# Altium schematic sheet FPGA_IO.SchDoc: FPGA IO
size 635 x 635 mm; Organization: UCLA High Energy Physics; DocumentNumber: 3; Revision: 2.0; SheetNumber: 3; SheetTotal: 12; CurrentDate: 8/7/2018; ModifiedDate: 8/20/2018; ProjectName: ALCT S-6 Optical Mezzanine
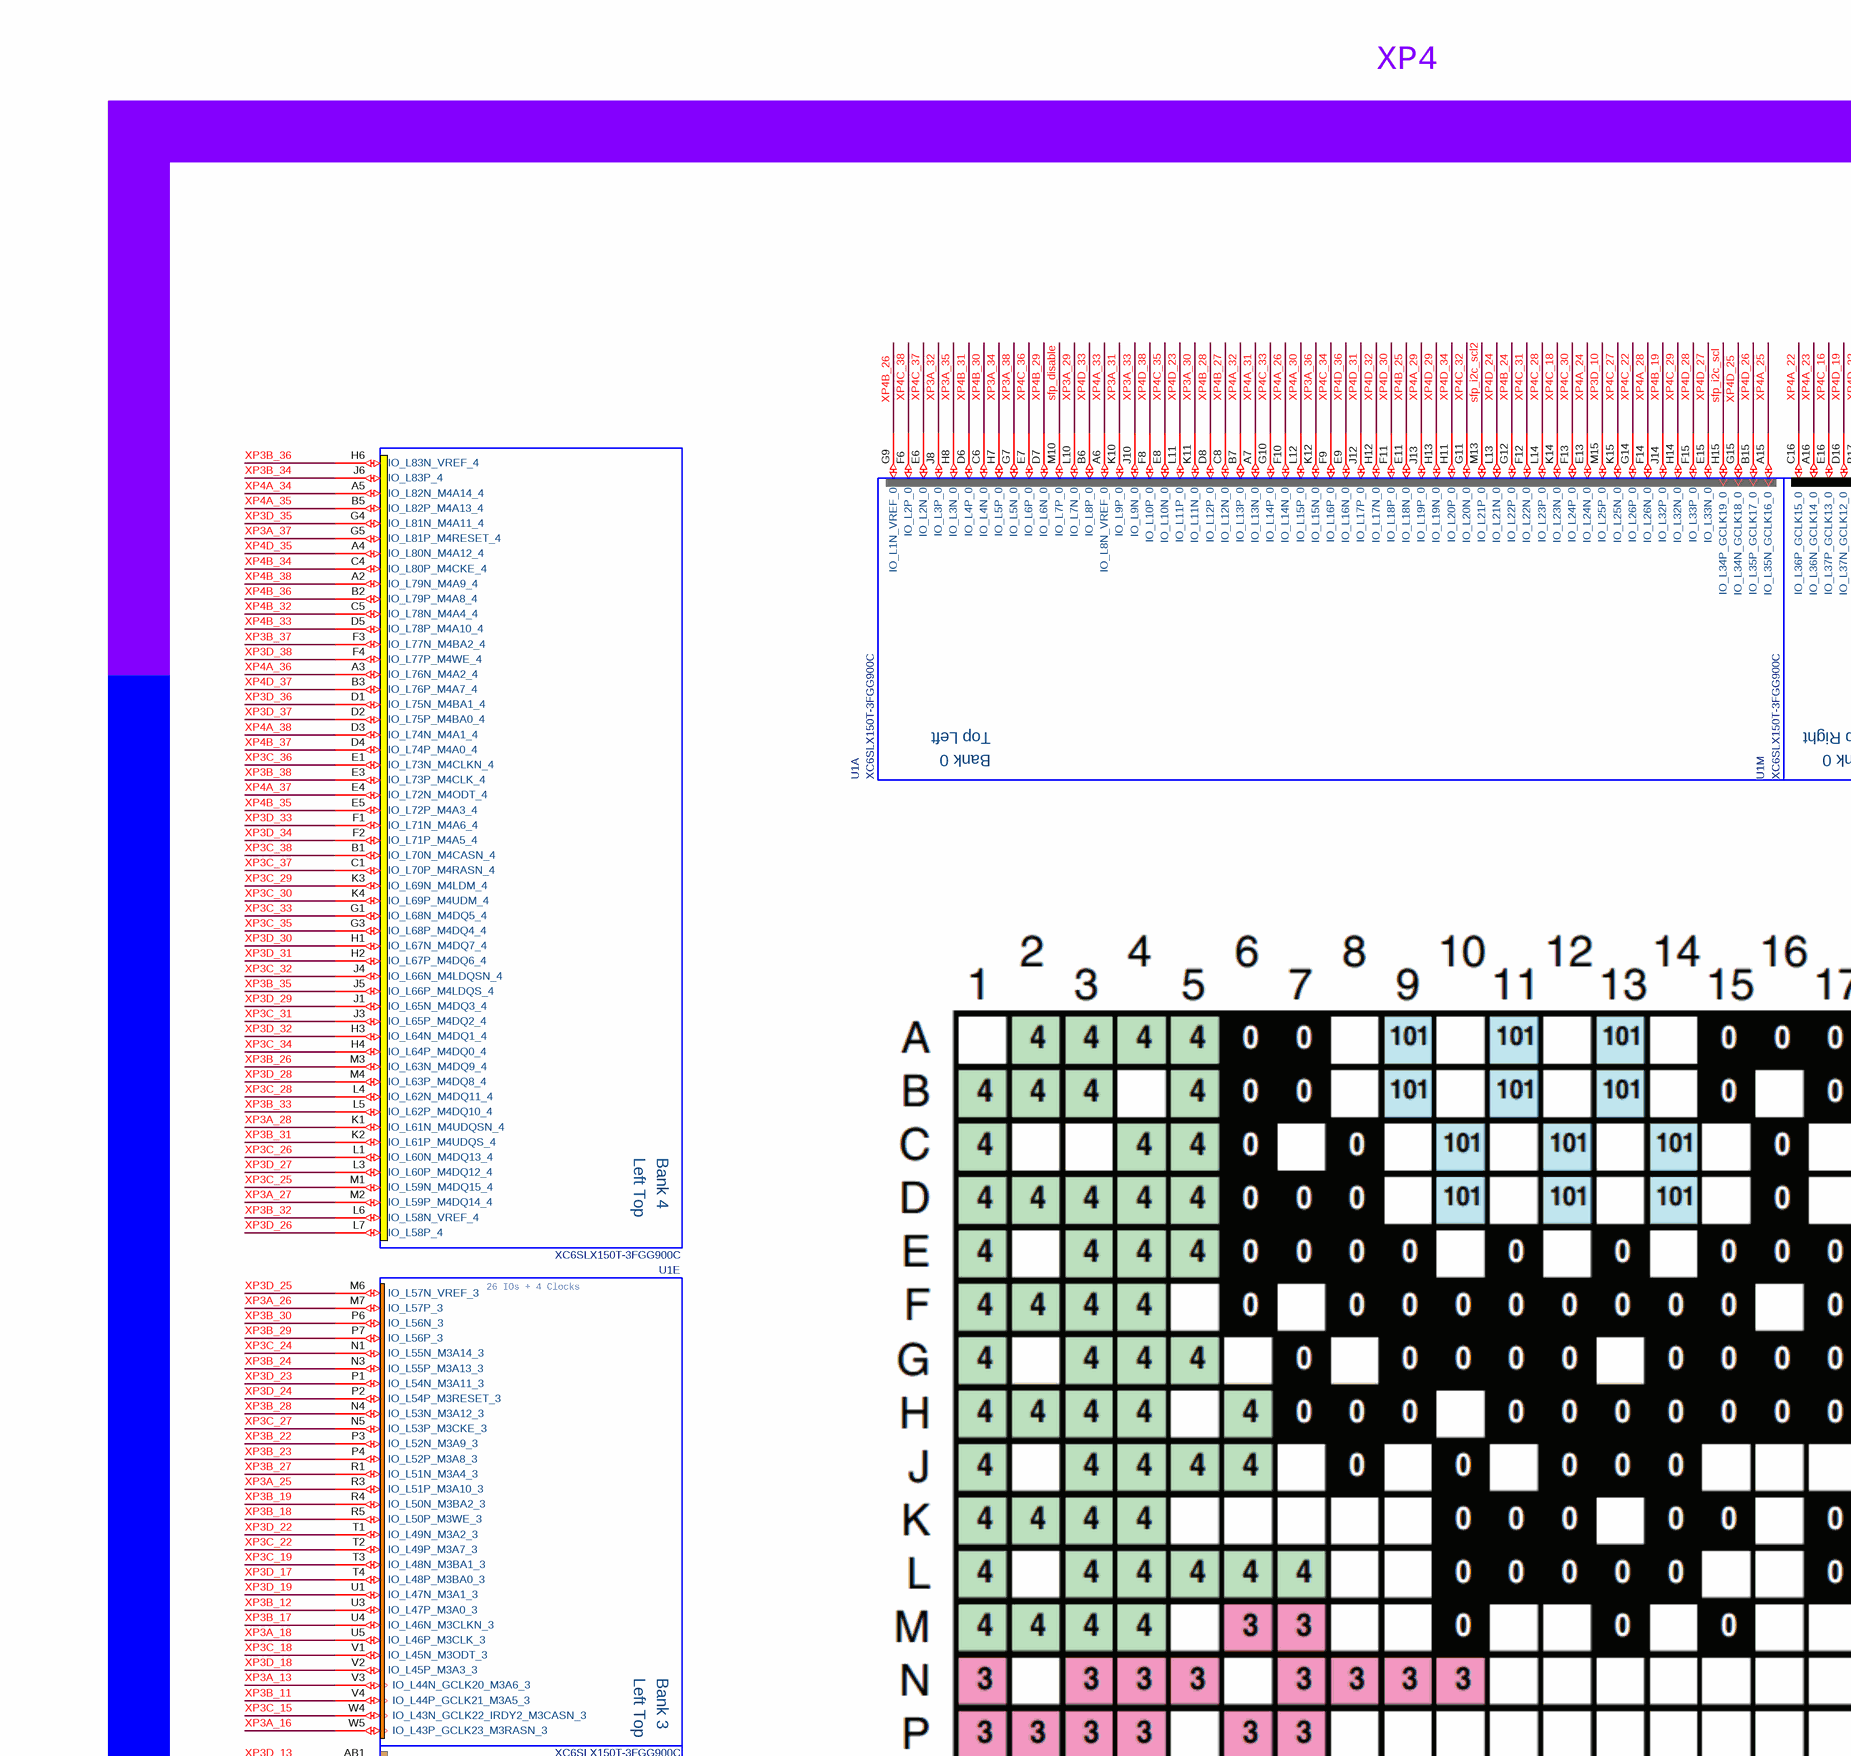
[diagram p0: FPGA_IO.SchDoc, top left]
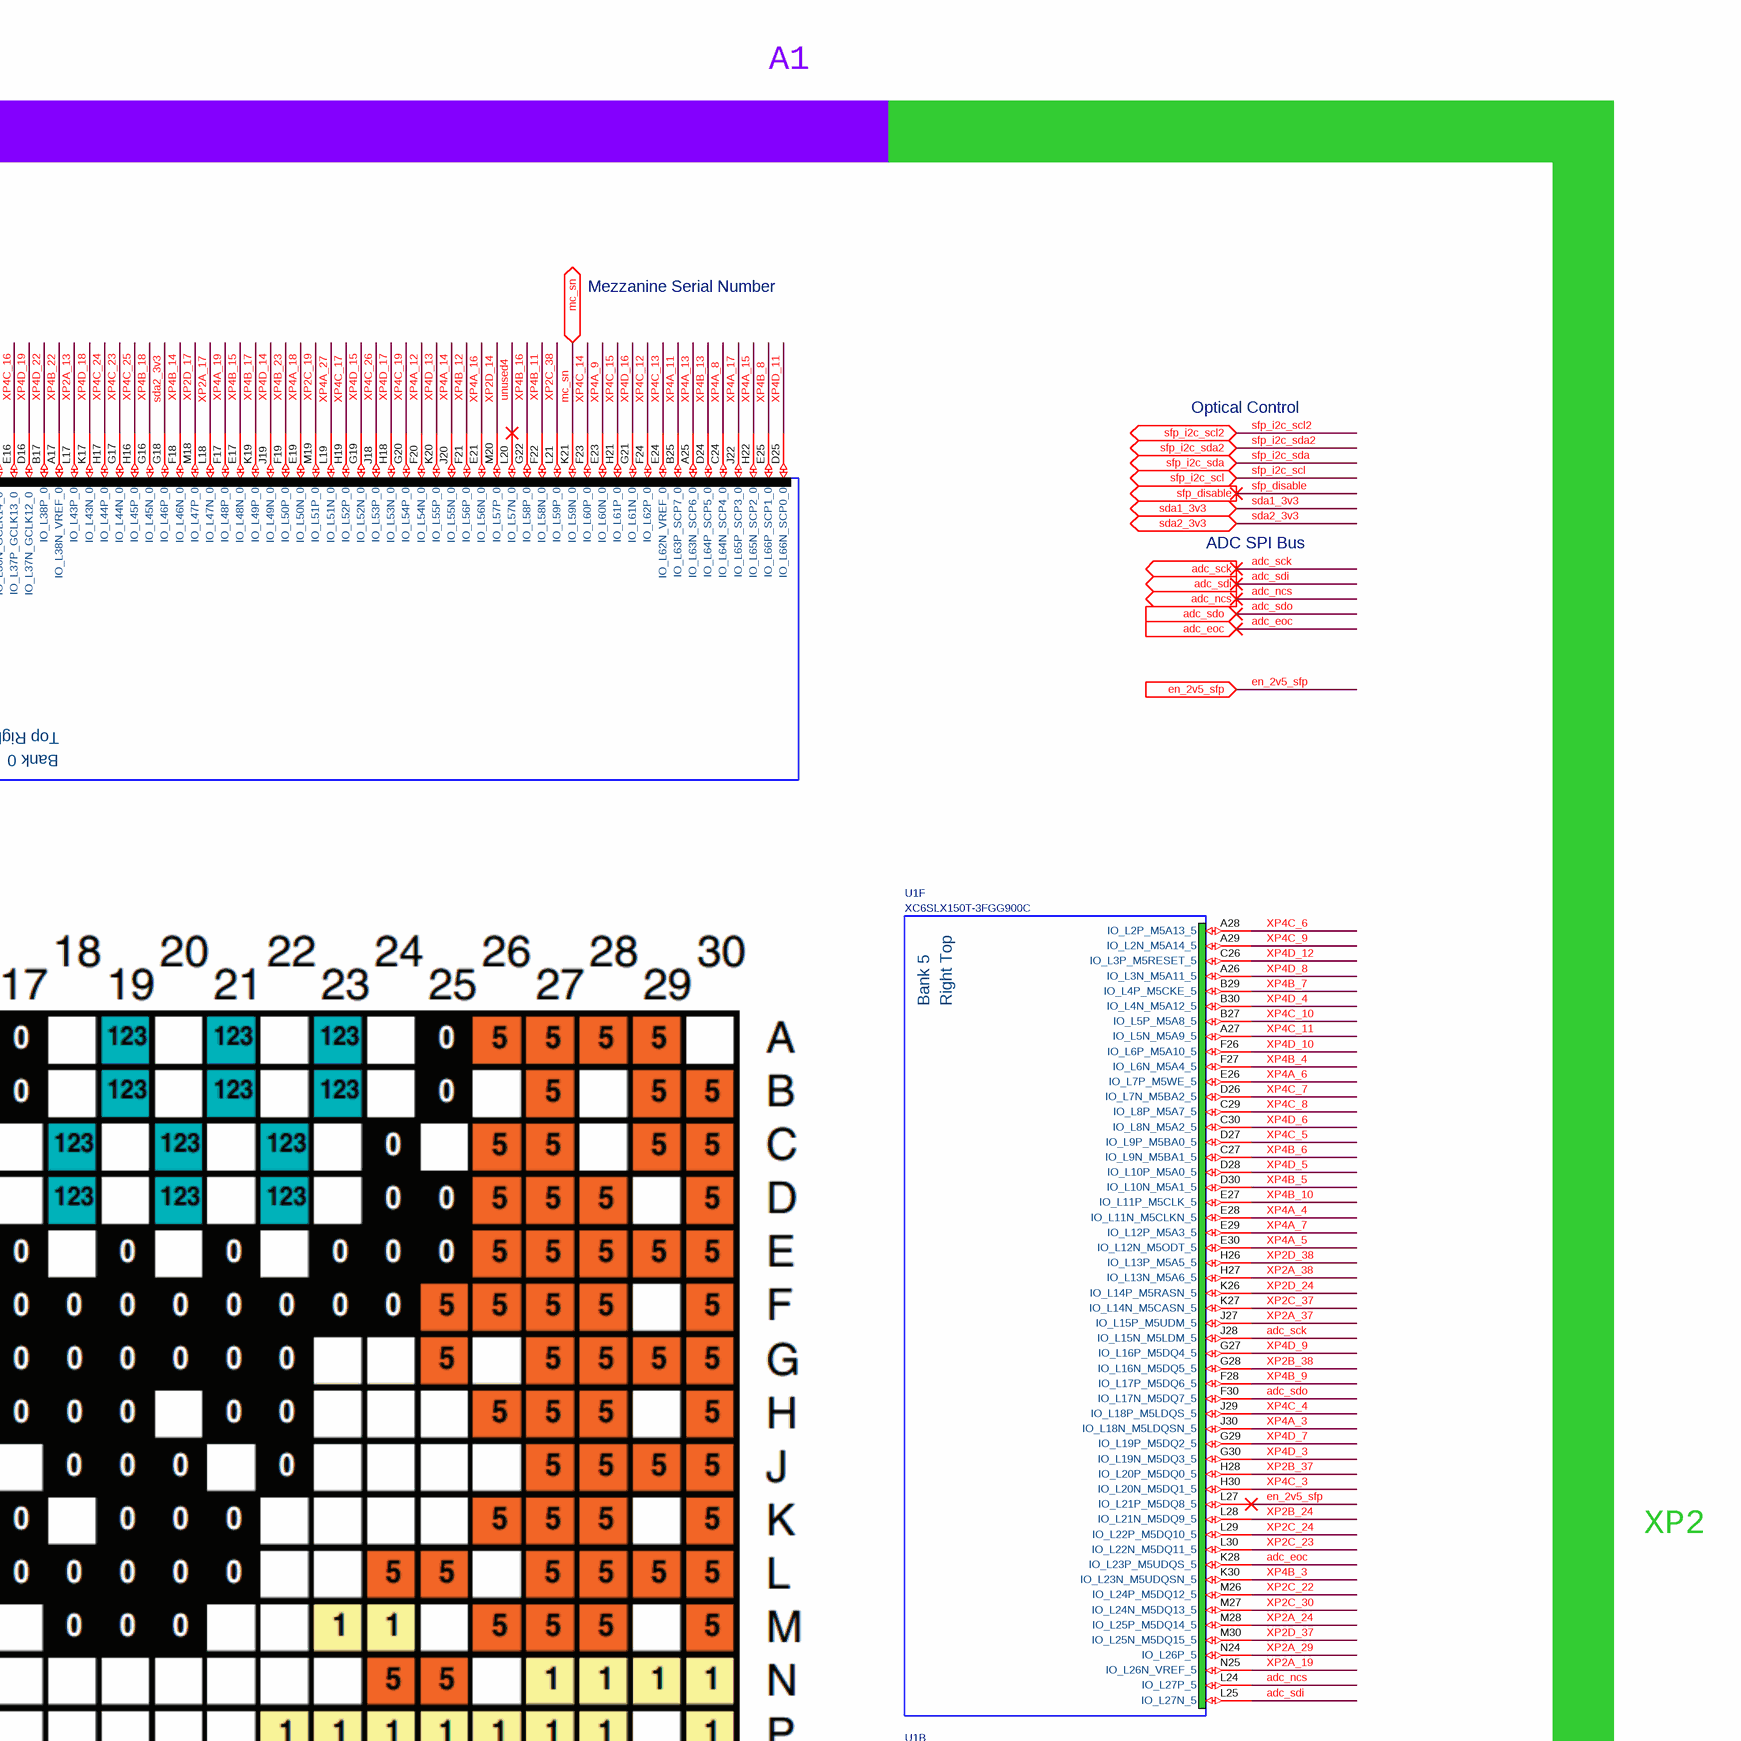
[diagram p1: FPGA_IO.SchDoc, top right]
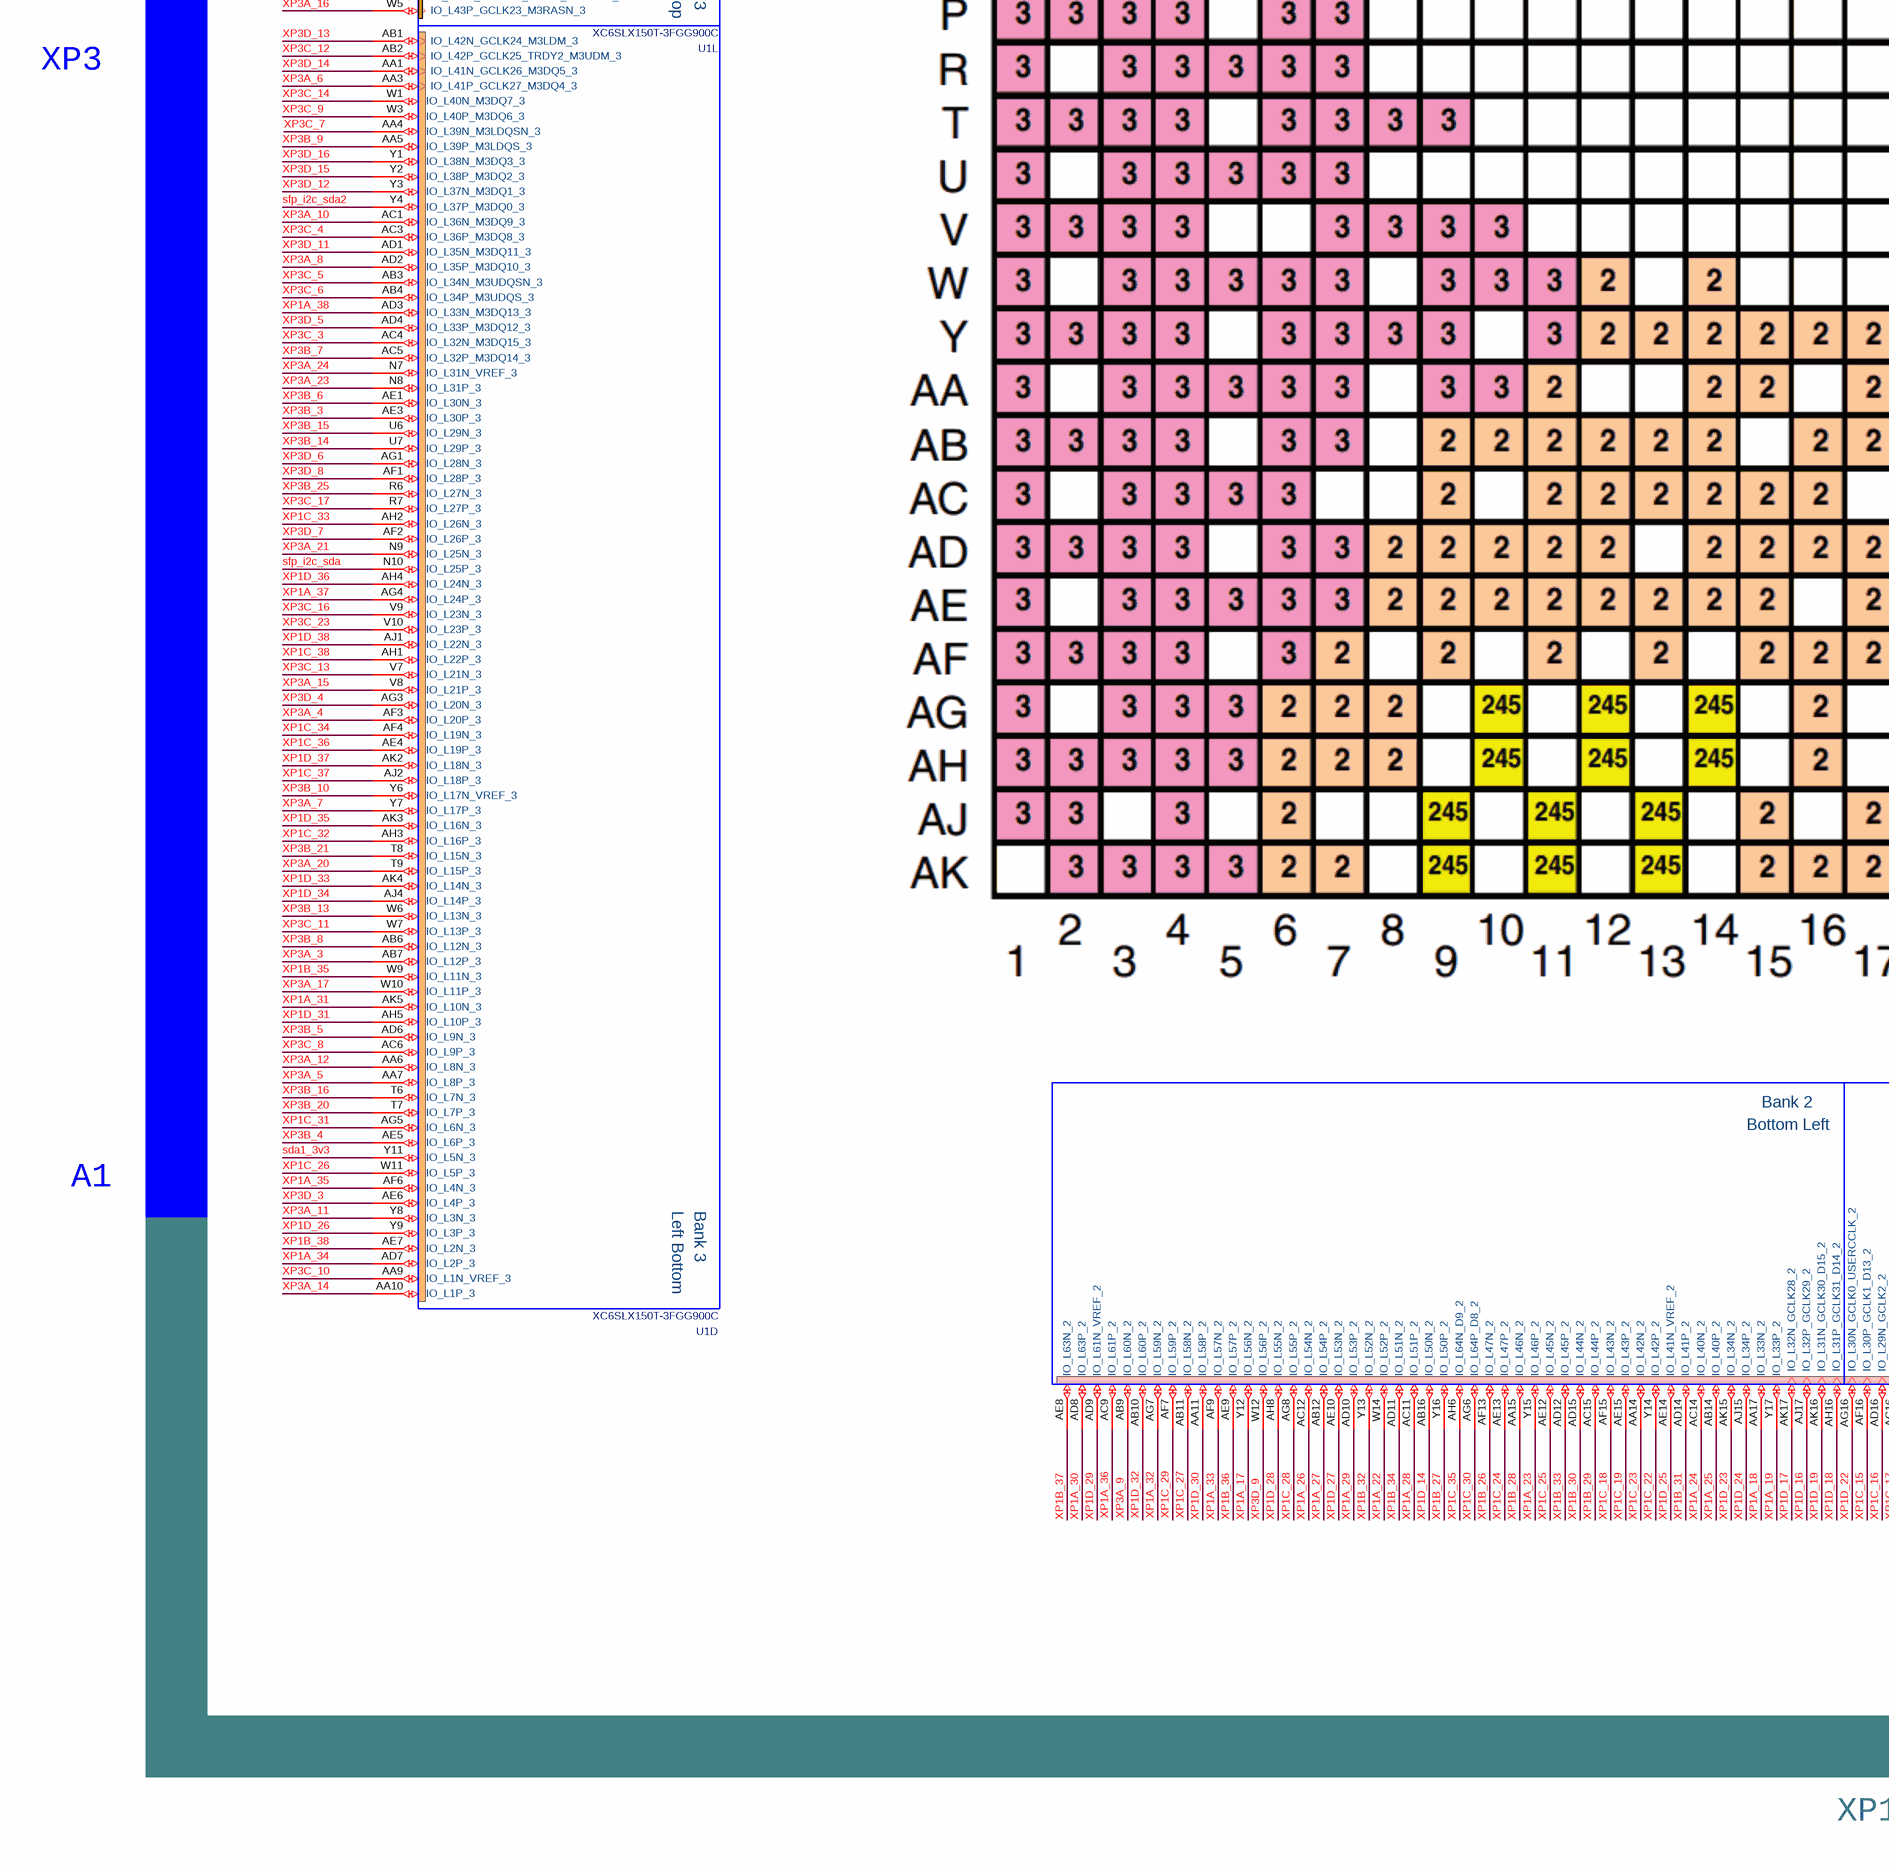
[diagram p2: FPGA_IO.SchDoc, bottom left]
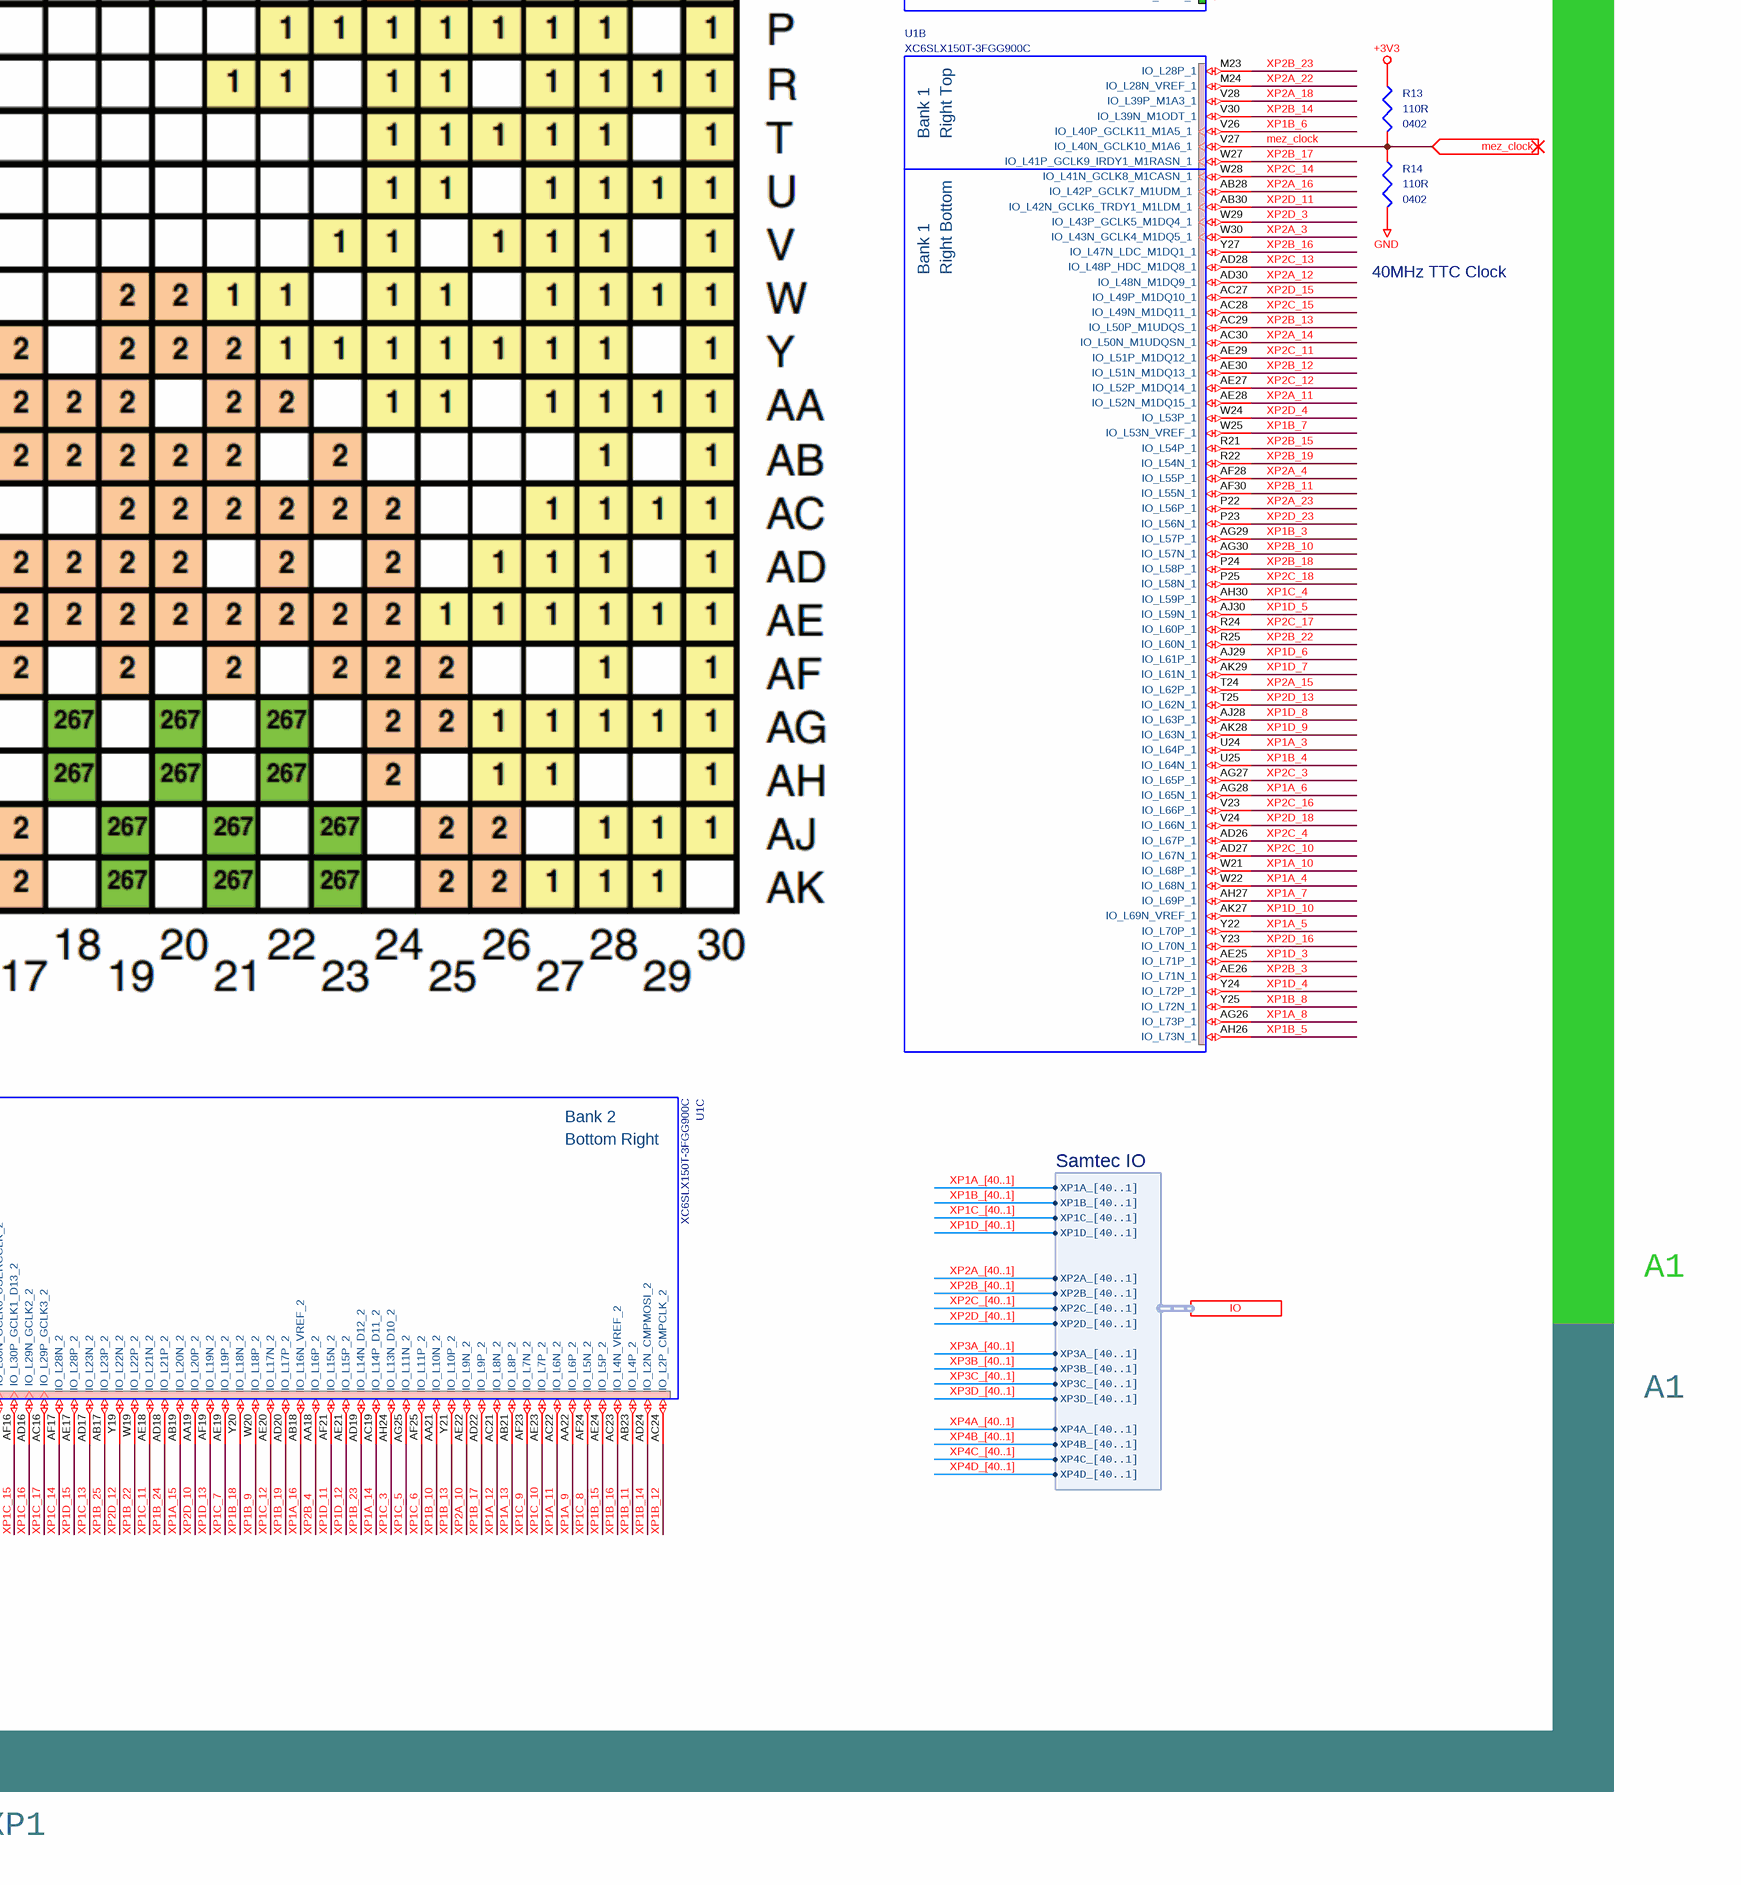
[diagram p3: FPGA_IO.SchDoc, bottom right]

## Parts
R13  110R  Supplier Device Package: 0402  [MC_S6/SM/R_0402_IPC]
R14  110R  Supplier Device Package: 0402  [MC_S6/SM/R_0402_IPC]
U1  XC6SLX150T-3FGG900C  [MC_S6/BGA/FGG900]  (parts A,B,C,D,E,F,L,M of 13)

## Ports
adc_eoc (in), adc_ncs (out), adc_sck (out), adc_sdi (out), adc_sdo (in), en_2v5_sfp (in), IO (harness Samtec IO), mc_sn (bidir), mez_clock (in), sda1_3v3 (bidir), sda2_3v3 (bidir), sfp_disable (out), sfp_i2c_scl2 (bidir), sfp_i2c_scl (bidir), sfp_i2c_sda2 (bidir), sfp_i2c_sda (bidir)

## Harnesses
Samtec IO: XP1A_[40..1], XP1B_[40..1], XP1C_[40..1], XP1D_[40..1], XP2A_[40..1], XP2B_[40..1], XP2C_[40..1], XP2D_[40..1], XP3A_[40..1], XP3B_[40..1], XP3C_[40..1], XP3D_[40..1], XP4A_[40..1], XP4B_[40..1], XP4C_[40..1], XP4D_[40..1]

## Nets
+3V3: R13.1
GND: R14.2
adc_eoc: U1.K28(IO_L23P_M5UDQS_5) ; port adc_eoc
adc_ncs: U1.L24(IO_L27P_5) ; port adc_ncs
adc_sck: U1.J28(IO_L15N_M5LDM_5) ; port adc_sck
adc_sdi: U1.L25(IO_L27N_5) ; port adc_sdi
adc_sdo: U1.F30(IO_L17N_M5DQ7_5) ; port adc_sdo
en_2v5_sfp: U1.L27(IO_L21P_M5DQ8_5) ; port en_2v5_sfp
mc_sn: U1.K21(IO_L59N_0) ; port mc_sn
mez_clock: R13.2 R14.1 U1.V27(IO_L40N_GCLK10_M1A6_1) ; port mez_clock
sda1_3v3: U1.Y11(IO_L5N_3) ; port sda1_3v3
sda2_3v3: U1.G18(IO_L46P_0) ; port sda2_3v3
sfp_disable: U1.M10(IO_L7P_0) ; port sfp_disable
sfp_i2c_scl: U1.H15(IO_L34P_GCLK19_0) ; port sfp_i2c_scl
sfp_i2c_scl2: U1.M13(IO_L21P_0) ; port sfp_i2c_scl2
sfp_i2c_sda: U1.N10(IO_L25P_3) ; port sfp_i2c_sda
sfp_i2c_sda2: U1.Y4(IO_L37P_M3DQ0_3) ; port sfp_i2c_sda2
unused4: U1.L20(IO_L57N_0)
XP1A_3: U1.U24(IO_L64P_1)
XP1A_4: U1.W22(IO_L68N_1)
XP1A_5: U1.Y22(IO_L70P_1)
XP1A_6: U1.AG28(IO_L65N_1)
XP1A_7: U1.AH27(IO_L69P_1)
XP1A_8: U1.AG26(IO_L73P_1)
XP1A_9: U1.AA22(IO_L6P_2)
XP1A_10: U1.W21(IO_L68P_1)
XP1A_11: U1.AC22(IO_L6N_2)
XP1A_12: U1.AC21(IO_L8N_2)
XP1A_13: U1.AB21(IO_L8P_2)
XP1A_14: U1.AC19(IO_L14P_D11_2)
XP1A_15: U1.AB19(IO_L20N_2)
XP1A_16: U1.AB18(IO_L16N_VREF_2)
XP1A_17: U1.Y12(IO_L56N_2)
XP1A_18: U1.AA17(IO_L33N_2)
XP1A_19: U1.Y17(IO_L33P_2)
XP1A_22: U1.W14(IO_L52P_2)
XP1A_23: U1.Y15(IO_L46P_2)
XP1A_24: U1.AC14(IO_L40N_2)
XP1A_25: U1.AB14(IO_L40P_2)
XP1A_26: U1.AC12(IO_L54N_2)
XP1A_27: U1.AB12(IO_L54P_2)
XP1A_28: U1.AC11(IO_L51P_2)
XP1A_29: U1.AD10(IO_L53P_2)
XP1A_30: U1.AD8(IO_L63P_2)
XP1A_31: U1.AK5(IO_L10N_3)
XP1A_32: U1.AG7(IO_L59N_2)
XP1A_33: U1.AF9(IO_L57N_2)
XP1A_34: U1.AD7(IO_L2P_3)
XP1A_35: U1.AF6(IO_L4N_3)
XP1A_36: U1.AC9(IO_L61P_2)
XP1A_37: U1.AG4(IO_L24P_3)
XP1A_38: U1.AD3(IO_L33N_M3DQ13_3)
XP1B_3: U1.AG29(IO_L57P_1)
XP1B_4: U1.U25(IO_L64N_1)
XP1B_5: U1.AH26(IO_L73N_1)
XP1B_6: U1.V26(IO_L40P_GCLK11_M1A5_1)
XP1B_7: U1.W25(IO_L53N_VREF_1)
XP1B_8: U1.Y25(IO_L72N_1)
XP1B_9: U1.W20(IO_L18P_2)
XP1B_10: U1.AA21(IO_L10N_2)
XP1B_11: U1.AB23(IO_L4P_2)
XP1B_12: U1.AC24(IO_L2P_CMPCLK_2)
XP1B_13: U1.Y21(IO_L10P_2)
XP1B_14: U1.AD24(IO_L2N_CMPMOSI_2)
XP1B_15: U1.AE24(IO_L5P_2)
XP1B_16: U1.AC23(IO_L4N_VREF_2)
XP1B_17: U1.AD22(IO_L9P_2)
XP1B_18: U1.Y20(IO_L18N_2)
XP1B_19: U1.AD20(IO_L17P_2)
XP1B_22: U1.W19(IO_L22P_2)
XP1B_23: U1.AD19(IO_L14N_D12_2)
XP1B_24: U1.AD18(IO_L21P_2)
XP1B_25: U1.AB17(IO_L23P_2)
XP1B_26: U1.AF13(IO_L47N_2)
XP1B_27: U1.Y16(IO_L50P_2)
XP1B_28: U1.AA15(IO_L46N_2)
XP1B_29: U1.AC15(IO_L44P_2)
XP1B_30: U1.AD15(IO_L44N_2)
XP1B_31: U1.AD14(IO_L41P_2)
XP1B_32: U1.Y13(IO_L52N_2)
XP1B_33: U1.AD12(IO_L45P_2)
XP1B_34: U1.AD11(IO_L51N_2)
XP1B_35: U1.W9(IO_L11N_3)
XP1B_36: U1.AE9(IO_L57P_2)
XP1B_37: U1.AE8(IO_L63N_2)
XP1B_38: U1.AE7(IO_L2N_3)
XP1C_3: U1.AH24(IO_L13N_D10_2)
XP1C_4: U1.AH30(IO_L59P_1)
XP1C_5: U1.AG25(IO_L11N_2)
XP1C_6: U1.AF25(IO_L11P_2)
XP1C_7: U1.AE19(IO_L19P_2)
XP1C_8: U1.AF24(IO_L5N_2)
XP1C_9: U1.AF23(IO_L7N_2)
XP1C_10: U1.AE23(IO_L7P_2)
XP1C_11: U1.AE18(IO_L21N_2)
XP1C_12: U1.AE20(IO_L17N_2)
XP1C_13: U1.AD17(IO_L23N_2)
XP1C_14: U1.AF17(IO_L28N_2)
XP1C_15: U1.AF16(IO_L30P_GCLK1_D13_2)
XP1C_16: U1.AD16(IO_L29N_GCLK2_2)
XP1C_17: U1.AC16(IO_L29P_GCLK3_2)
XP1C_18: U1.AF15(IO_L43N_2)
XP1C_19: U1.AE15(IO_L43P_2)
XP1C_22: U1.Y14(IO_L42P_2)
XP1C_23: U1.AA14(IO_L42N_2)
XP1C_24: U1.AE13(IO_L47P_2)
XP1C_25: U1.AE12(IO_L45N_2)
XP1C_26: U1.W11(IO_L5P_3)
XP1C_27: U1.AB11(IO_L58N_2)
XP1C_28: U1.AG8(IO_L55P_2)
XP1C_29: U1.AF7(IO_L59P_2)
XP1C_30: U1.AG6(IO_L64P_D8_2)
XP1C_31: U1.AG5(IO_L6N_3)
XP1C_32: U1.AH3(IO_L16P_3)
XP1C_33: U1.AH2(IO_L26N_3)
XP1C_34: U1.AF4(IO_L19N_3)
XP1C_35: U1.AH6(IO_L64N_D9_2)
XP1C_36: U1.AE4(IO_L19P_3)
XP1C_37: U1.AJ2(IO_L18P_3)
XP1C_38: U1.AH1(IO_L22P_3)
XP1D_3: U1.AE25(IO_L71P_1)
XP1D_4: U1.Y24(IO_L72P_1)
XP1D_5: U1.AJ30(IO_L59N_1)
XP1D_6: U1.AJ29(IO_L61P_1)
XP1D_7: U1.AK29(IO_L61N_1)
XP1D_8: U1.AJ28(IO_L63P_1)
XP1D_9: U1.AK28(IO_L63N_1)
XP1D_10: U1.AK27(IO_L69N_VREF_1)
XP1D_11: U1.AF21(IO_L15N_2)
XP1D_12: U1.AE21(IO_L15P_2)
XP1D_13: U1.AF19(IO_L19N_2)
XP1D_14: U1.AB16(IO_L50N_2)
XP1D_15: U1.AE17(IO_L28P_2)
XP1D_16: U1.AJ17(IO_L32P_GCLK29_2)
XP1D_17: U1.AK17(IO_L32N_GCLK28_2)
XP1D_18: U1.AH16(IO_L31P_GCLK31_D14_2)
XP1D_19: U1.AK16(IO_L31N_GCLK30_D15_2)
XP1D_22: U1.AG16(IO_L30N_GCLK0_USERCCLK_2)
XP1D_23: U1.AK15(IO_L34N_2)
XP1D_24: U1.AJ15(IO_L34P_2)
XP1D_25: U1.AE14(IO_L41N_VREF_2)
XP1D_26: U1.Y9(IO_L3P_3)
XP1D_27: U1.AE10(IO_L53N_2)
XP1D_28: U1.AH8(IO_L55N_2)
XP1D_29: U1.AD9(IO_L61N_VREF_2)
XP1D_30: U1.AA11(IO_L58P_2)
XP1D_31: U1.AH5(IO_L10P_3)
XP1D_32: U1.AB10(IO_L60P_2)
XP1D_33: U1.AK4(IO_L14N_3)
XP1D_34: U1.AJ4(IO_L14P_3)
XP1D_35: U1.AK3(IO_L16N_3)
XP1D_36: U1.AH4(IO_L24N_3)
XP1D_37: U1.AK2(IO_L18N_3)
XP1D_38: U1.AJ1(IO_L22N_3)
XP2A_3: U1.W30(IO_L43N_GCLK4_M1DQ5_1)
XP2A_4: U1.AF28(IO_L55P_1)
XP2A_10: U1.AE22(IO_L9N_2)
XP2A_11: U1.AE28(IO_L52N_M1DQ15_1)
XP2A_12: U1.AD30(IO_L48N_M1DQ9_1)
XP2A_13: U1.L17(IO_L43P_0)
XP2A_14: U1.AC30(IO_L50N_M1UDQSN_1)
XP2A_15: U1.T24(IO_L62P_1)
XP2A_16: U1.AB28(IO_L42P_GCLK7_M1UDM_1)
XP2A_17: U1.L18(IO_L47N_0)
XP2A_18: U1.V28(IO_L39P_M1A3_1)
XP2A_19: U1.N25(IO_L26N_VREF_5)
XP2A_22: U1.M24(IO_L28N_VREF_1)
XP2A_23: U1.P22(IO_L56P_1)
XP2A_24: U1.M28(IO_L25P_M5DQ14_5)
XP2A_29: U1.N24(IO_L26P_5)
XP2A_37: U1.J27(IO_L15P_M5UDM_5)
XP2A_38: U1.H27(IO_L13N_M5A6_5)
XP2B_3: U1.AE26(IO_L71N_1)
XP2B_4: U1.AA18(IO_L16P_2)
XP2B_10: U1.AG30(IO_L57N_1)
XP2B_11: U1.AF30(IO_L55N_1)
XP2B_12: U1.AE30(IO_L51N_M1DQ13_1)
XP2B_13: U1.AC29(IO_L50P_M1UDQS_1)
XP2B_14: U1.V30(IO_L39N_M1ODT_1)
XP2B_15: U1.R21(IO_L54P_1)
XP2B_16: U1.Y27(IO_L47N_LDC_M1DQ1_1)
XP2B_17: U1.W27(IO_L41P_GCLK9_IRDY1_M1RASN_1)
XP2B_18: U1.P24(IO_L58P_1)
XP2B_19: U1.R22(IO_L54N_1)
XP2B_22: U1.R25(IO_L60N_1)
XP2B_23: U1.M23(IO_L28P_1)
XP2B_24: U1.L28(IO_L21N_M5DQ9_5)
XP2B_37: U1.H28(IO_L20P_M5DQ0_5)
XP2B_38: U1.G28(IO_L16N_M5DQ5_5)
XP2C_3: U1.AG27(IO_L65P_1)
XP2C_4: U1.AD26(IO_L67P_1)
XP2C_10: U1.AD27(IO_L67N_1)
XP2C_11: U1.AE29(IO_L51P_M1DQ12_1)
XP2C_12: U1.AE27(IO_L52P_M1DQ14_1)
XP2C_13: U1.AD28(IO_L48P_HDC_M1DQ8_1)
XP2C_14: U1.W28(IO_L41N_GCLK8_M1CASN_1)
XP2C_15: U1.AC28(IO_L49N_M1DQ11_1)
XP2C_16: U1.V23(IO_L66P_1)
XP2C_17: U1.R24(IO_L60P_1)
XP2C_18: U1.P25(IO_L58N_1)
XP2C_19: U1.M19(IO_L51P_0)
XP2C_22: U1.M26(IO_L24P_M5DQ12_5)
XP2C_23: U1.L30(IO_L22N_M5DQ11_5)
XP2C_24: U1.L29(IO_L22P_M5DQ10_5)
XP2C_30: U1.M27(IO_L24N_M5DQ13_5)
XP2C_37: U1.K27(IO_L14N_M5CASN_5)
XP2C_38: U1.L21(IO_L59P_0)
XP2D_3: U1.W29(IO_L43P_GCLK5_M1DQ4_1)
XP2D_4: U1.W24(IO_L53P_1)
XP2D_10: U1.AA19(IO_L20P_2)
XP2D_11: U1.AB30(IO_L42N_GCLK6_TRDY1_M1LDM_1)
XP2D_12: U1.Y19(IO_L22N_2)
XP2D_13: U1.T25(IO_L62N_1)
XP2D_14: U1.M20(IO_L57P_0)
XP2D_15: U1.AC27(IO_L49P_M1DQ10_1)
XP2D_16: U1.Y23(IO_L70N_1)
XP2D_17: U1.M18(IO_L47P_0)
XP2D_18: U1.V24(IO_L66N_1)
XP2D_23: U1.P23(IO_L56N_1)
XP2D_24: U1.K26(IO_L14P_M5RASN_5)
XP2D_37: U1.M30(IO_L25N_M5DQ15_5)
XP2D_38: U1.H26(IO_L13P_M5A5_5)
XP3A_3: U1.AB7(IO_L12P_3)
XP3A_4: U1.AF3(IO_L20P_3)
XP3A_5: U1.AA7(IO_L8P_3)
XP3A_6: U1.AA3(IO_L41P_GCLK27_M3DQ4_3)
XP3A_7: U1.Y7(IO_L17P_3)
XP3A_8: U1.AD2(IO_L35P_M3DQ10_3)
XP3A_9: U1.AB9(IO_L60N_2)
XP3A_10: U1.AC1(IO_L36N_M3DQ9_3)
XP3A_11: U1.Y8(IO_L3N_3)
XP3A_12: U1.AA6(IO_L8N_3)
XP3A_13: U1.V3(IO_L44N_GCLK20_M3A6_3)
XP3A_14: U1.AA10(IO_L1P_3)
XP3A_15: U1.V8(IO_L21P_3)
XP3A_16: U1.W5(IO_L43P_GCLK23_M3RASN_3)
XP3A_17: U1.W10(IO_L11P_3)
XP3A_18: U1.U5(IO_L46P_M3CLK_3)
XP3A_20: U1.T9(IO_L15P_3)
XP3A_21: U1.N9(IO_L25N_3)
XP3A_23: U1.N8(IO_L31P_3)
XP3A_24: U1.N7(IO_L31N_VREF_3)
XP3A_25: U1.R3(IO_L51P_M3A10_3)
XP3A_26: U1.M7(IO_L57P_3)
XP3A_27: U1.M2(IO_L59P_M4DQ14_4)
XP3A_28: U1.K1(IO_L61N_M4UDQSN_4)
XP3A_29: U1.L10(IO_L7N_0)
XP3A_30: U1.K11(IO_L11N_0)
XP3A_31: U1.K10(IO_L9P_0)
XP3A_32: U1.J8(IO_L3P_0)
XP3A_33: U1.J10(IO_L9N_0)
XP3A_34: U1.H7(IO_L5P_0)
XP3A_35: U1.H8(IO_L3N_0)
XP3A_36: U1.K12(IO_L15N_0)
XP3A_37: U1.G5(IO_L81P_M4RESET_4)
XP3A_38: U1.G7(IO_L5N_0)
XP3B_3: U1.AE3(IO_L30P_3)
XP3B_4: U1.AE5(IO_L6P_3)
XP3B_5: U1.AD6(IO_L9N_3)
XP3B_6: U1.AE1(IO_L30N_3)
XP3B_7: U1.AC5(IO_L32P_M3DQ14_3)
XP3B_8: U1.AB6(IO_L12N_3)
XP3B_9: U1.AA5(IO_L39P_M3LDQS_3)
XP3B_10: U1.Y6(IO_L17N_VREF_3)
XP3B_11: U1.V4(IO_L44P_GCLK21_M3A5_3)
XP3B_12: U1.U3(IO_L47P_M3A0_3)
XP3B_13: U1.W6(IO_L13N_3)
XP3B_14: U1.U7(IO_L29P_3)
XP3B_15: U1.U6(IO_L29N_3)
XP3B_16: U1.T6(IO_L7N_3)
XP3B_17: U1.U4(IO_L46N_M3CLKN_3)
XP3B_18: U1.R5(IO_L50P_M3WE_3)
XP3B_19: U1.R4(IO_L50N_M3BA2_3)
XP3B_20: U1.T7(IO_L7P_3)
XP3B_21: U1.T8(IO_L15N_3)
XP3B_22: U1.P3(IO_L52N_M3A9_3)
XP3B_23: U1.P4(IO_L52P_M3A8_3)
XP3B_24: U1.N3(IO_L55P_M3A13_3)
XP3B_25: U1.R6(IO_L27N_3)
XP3B_26: U1.M3(IO_L63N_M4DQ9_4)
XP3B_27: U1.R1(IO_L51N_M3A4_3)
XP3B_28: U1.N4(IO_L53N_M3A12_3)
XP3B_29: U1.P7(IO_L56P_3)
XP3B_30: U1.P6(IO_L56N_3)
XP3B_31: U1.K2(IO_L61P_M4UDQS_4)
XP3B_32: U1.L6(IO_L58N_VREF_4)
XP3B_33: U1.L5(IO_L62P_M4DQ10_4)
XP3B_34: U1.J6(IO_L83P_4)
XP3B_35: U1.J5(IO_L66P_M4LDQS_4)
XP3B_36: U1.H6(IO_L83N_VREF_4)
XP3B_37: U1.F3(IO_L77N_M4BA2_4)
XP3B_38: U1.E3(IO_L73P_M4CLK_4)
XP3C_3: U1.AC4(IO_L32N_M3DQ15_3)
XP3C_4: U1.AC3(IO_L36P_M3DQ8_3)
XP3C_5: U1.AB3(IO_L34N_M3UDQSN_3)
XP3C_6: U1.AB4(IO_L34P_M3UDQS_3)
XP3C_7: U1.AA4(IO_L39N_M3LDQSN_3)
XP3C_8: U1.AC6(IO_L9P_3)
XP3C_9: U1.W3(IO_L40P_M3DQ6_3)
XP3C_10: U1.AA9(IO_L1N_VREF_3)
XP3C_11: U1.W7(IO_L13P_3)
XP3C_12: U1.AB2(IO_L42P_GCLK25_TRDY2_M3UDM_3)
XP3C_13: U1.V7(IO_L21N_3)
XP3C_14: U1.W1(IO_L40N_M3DQ7_3)
XP3C_15: U1.W4(IO_L43N_GCLK22_IRDY2_M3CASN_3)
XP3C_16: U1.V9(IO_L23N_3)
XP3C_17: U1.R7(IO_L27P_3)
XP3C_18: U1.V1(IO_L45N_M3ODT_3)
XP3C_19: U1.T3(IO_L48N_M3BA1_3)
XP3C_22: U1.T2(IO_L49P_M3A7_3)
XP3C_23: U1.V10(IO_L23P_3)
XP3C_24: U1.N1(IO_L55N_M3A14_3)
XP3C_25: U1.M1(IO_L59N_M4DQ15_4)
XP3C_26: U1.L1(IO_L60N_M4DQ13_4)
XP3C_27: U1.N5(IO_L53P_M3CKE_3)
XP3C_28: U1.L4(IO_L62N_M4DQ11_4)
XP3C_29: U1.K3(IO_L69N_M4LDM_4)
XP3C_30: U1.K4(IO_L69P_M4UDM_4)
XP3C_31: U1.J3(IO_L65P_M4DQ2_4)
XP3C_32: U1.J4(IO_L66N_M4LDQSN_4)
XP3C_33: U1.G1(IO_L68N_M4DQ5_4)
XP3C_34: U1.H4(IO_L64P_M4DQ0_4)
XP3C_35: U1.G3(IO_L68P_M4DQ4_4)
XP3C_36: U1.E1(IO_L73N_M4CLKN_4)
XP3C_37: U1.C1(IO_L70P_M4RASN_4)
XP3C_38: U1.B1(IO_L70N_M4CASN_4)
XP3D_3: U1.AE6(IO_L4P_3)
XP3D_4: U1.AG3(IO_L20N_3)
XP3D_5: U1.AD4(IO_L33P_M3DQ12_3)
XP3D_6: U1.AG1(IO_L28N_3)
XP3D_7: U1.AF2(IO_L26P_3)
XP3D_8: U1.AF1(IO_L28P_3)
XP3D_9: U1.W12(IO_L56P_2)
XP3D_10: U1.M15(IO_L25P_0)
XP3D_11: U1.AD1(IO_L35N_M3DQ11_3)
XP3D_12: U1.Y3(IO_L37N_M3DQ1_3)
XP3D_13: U1.AB1(IO_L42N_GCLK24_M3LDM_3)
XP3D_14: U1.AA1(IO_L41N_GCLK26_M3DQ5_3)
XP3D_15: U1.Y2(IO_L38P_M3DQ2_3)
XP3D_16: U1.Y1(IO_L38N_M3DQ3_3)
XP3D_17: U1.T4(IO_L48P_M3BA0_3)
XP3D_18: U1.V2(IO_L45P_M3A3_3)
XP3D_19: U1.U1(IO_L47N_M3A1_3)
XP3D_22: U1.T1(IO_L49N_M3A2_3)
XP3D_23: U1.P1(IO_L54N_M3A11_3)
XP3D_24: U1.P2(IO_L54P_M3RESET_3)
XP3D_25: U1.M6(IO_L57N_VREF_3)
XP3D_26: U1.L7(IO_L58P_4)
XP3D_27: U1.L3(IO_L60P_M4DQ12_4)
XP3D_28: U1.M4(IO_L63P_M4DQ8_4)
XP3D_29: U1.J1(IO_L65N_M4DQ3_4)
XP3D_30: U1.H1(IO_L67N_M4DQ7_4)
XP3D_31: U1.H2(IO_L67P_M4DQ6_4)
XP3D_32: U1.H3(IO_L64N_M4DQ1_4)
XP3D_33: U1.F1(IO_L71N_M4A6_4)
XP3D_34: U1.F2(IO_L71P_M4A5_4)
XP3D_35: U1.G4(IO_L81N_M4A11_4)
XP3D_36: U1.D1(IO_L75N_M4BA1_4)
XP3D_37: U1.D2(IO_L75P_M4BA0_4)
XP3D_38: U1.F4(IO_L77P_M4WE_4)
XP4A_3: U1.J30(IO_L18N_M5LDQSN_5)
XP4A_4: U1.E28(IO_L11N_M5CLKN_5)
XP4A_5: U1.E30(IO_L12N_M5ODT_5)
XP4A_6: U1.E26(IO_L7P_M5WE_5)
XP4A_7: U1.E29(IO_L12P_M5A3_5)
XP4A_8: U1.C24(IO_L64N_SCP4_0)
XP4A_9: U1.E23(IO_L60N_0)
XP4A_11: U1.B25(IO_L63P_SCP7_0)
XP4A_12: U1.F20(IO_L54N_0)
XP4A_13: U1.A25(IO_L63N_SCP6_0)
XP4A_14: U1.J20(IO_L55N_0)
XP4A_15: U1.H22(IO_L65N_SCP2_0)
XP4A_16: U1.E21(IO_L56N_0)
XP4A_17: U1.J22(IO_L65P_SCP3_0)
XP4A_18: U1.E19(IO_L50N_0)
XP4A_19: U1.F17(IO_L48P_0)
XP4A_22: U1.C16(IO_L36P_GCLK15_0)
XP4A_23: U1.A16(IO_L36N_GCLK14_0)
XP4A_24: U1.E13(IO_L24N_0)
XP4A_25: U1.A15(IO_L35N_GCLK16_0)
XP4A_26: U1.F10(IO_L14N_0)
XP4A_27: U1.L19(IO_L51N_0)
XP4A_28: U1.F14(IO_L26N_0)
XP4A_29: U1.J13(IO_L19P_0)
XP4A_30: U1.L12(IO_L15P_0)
XP4A_31: U1.A7(IO_L13N_0)
XP4A_32: U1.B7(IO_L13P_0)
XP4A_33: U1.A6(IO_L8N_VREF_0)
XP4A_34: U1.A5(IO_L82N_M4A14_4)
XP4A_35: U1.B5(IO_L82P_M4A13_4)
XP4A_36: U1.A3(IO_L76N_M4A2_4)
XP4A_37: U1.E4(IO_L72N_M4ODT_4)
XP4A_38: U1.D3(IO_L74N_M4A1_4)
XP4B_3: U1.K30(IO_L23N_M5UDQSN_5)
XP4B_4: U1.F27(IO_L6N_M5A4_5)
XP4B_5: U1.D30(IO_L10N_M5A1_5)
XP4B_6: U1.C27(IO_L9N_M5BA1_5)
XP4B_7: U1.B29(IO_L4P_M5CKE_5)
XP4B_8: U1.E25(IO_L66P_SCP1_0)
XP4B_9: U1.F28(IO_L17P_M5DQ6_5)
XP4B_10: U1.E27(IO_L11P_M5CLK_5)
XP4B_11: U1.F22(IO_L58N_0)
XP4B_12: U1.F21(IO_L56P_0)
XP4B_13: U1.D24(IO_L64P_SCP5_0)
XP4B_14: U1.F18(IO_L46N_0)
XP4B_15: U1.E17(IO_L48N_0)
XP4B_16: U1.G22(IO_L58P_0)
XP4B_17: U1.K19(IO_L49P_0)
XP4B_18: U1.G16(IO_L45N_0)
XP4B_19: U1.J14(IO_L32P_0)
XP4B_22: U1.A17(IO_L38N_VREF_0)
XP4B_23: U1.F19(IO_L50P_0)
XP4B_24: U1.G12(IO_L22P_0)
XP4B_25: U1.E11(IO_L18N_0)
XP4B_26: U1.G9(IO_L1N_VREF_0)
XP4B_27: U1.C8(IO_L12N_0)
XP4B_28: U1.D8(IO_L12P_0)
XP4B_29: U1.D7(IO_L6N_0)
XP4B_30: U1.C6(IO_L4N_0)
XP4B_31: U1.D6(IO_L4P_0)
XP4B_32: U1.C5(IO_L78N_M4A4_4)
XP4B_33: U1.D5(IO_L78P_M4A10_4)
XP4B_34: U1.C4(IO_L80P_M4CKE_4)
XP4B_35: U1.E5(IO_L72P_M4A3_4)
XP4B_36: U1.B2(IO_L79P_M4A8_4)
XP4B_37: U1.D4(IO_L74P_M4A0_4)
XP4B_38: U1.A2(IO_L79N_M4A9_4)
XP4C_3: U1.H30(IO_L20N_M5DQ1_5)
XP4C_4: U1.J29(IO_L18P_M5LDQS_5)
XP4C_5: U1.D27(IO_L9P_M5BA0_5)
XP4C_6: U1.A28(IO_L2P_M5A13_5)
XP4C_7: U1.D26(IO_L7N_M5BA2_5)
XP4C_8: U1.C29(IO_L8P_M5A7_5)
XP4C_9: U1.A29(IO_L2N_M5A14_5)
XP4C_10: U1.B27(IO_L5P_M5A8_5)
XP4C_11: U1.A27(IO_L5N_M5A9_5)
XP4C_12: U1.F24(IO_L62P_0)
XP4C_13: U1.E24(IO_L62N_VREF_0)
XP4C_14: U1.F23(IO_L60P_0)
XP4C_15: U1.H21(IO_L61P_0)
XP4C_16: U1.E16(IO_L37P_GCLK13_0)
XP4C_17: U1.H19(IO_L52P_0)
XP4C_18: U1.K14(IO_L23N_0)
XP4C_19: U1.G20(IO_L54P_0)
XP4C_22: U1.G14(IO_L26P_0)
XP4C_23: U1.G17(IO_L44N_0)
XP4C_24: U1.H17(IO_L44P_0)
XP4C_25: U1.H16(IO_L45P_0)
XP4C_26: U1.J18(IO_L53P_0)
XP4C_27: U1.K15(IO_L25N_0)
XP4C_28: U1.L14(IO_L23P_0)
XP4C_29: U1.H14(IO_L32N_0)
XP4C_30: U1.F13(IO_L24P_0)
XP4C_31: U1.F12(IO_L22N_0)
XP4C_32: U1.G11(IO_L20N_0)
XP4C_33: U1.G10(IO_L14P_0)
XP4C_34: U1.F9(IO_L16P_0)
XP4C_35: U1.E8(IO_L10N_0)
XP4C_36: U1.E7(IO_L6P_0)
XP4C_37: U1.E6(IO_L2N_0)
XP4C_38: U1.F6(IO_L2P_0)
XP4D_3: U1.G30(IO_L19N_M5DQ3_5)
XP4D_4: U1.B30(IO_L4N_M5A12_5)
XP4D_5: U1.D28(IO_L10P_M5A0_5)
XP4D_6: U1.C30(IO_L8N_M5A2_5)
XP4D_7: U1.G29(IO_L19P_M5DQ2_5)
XP4D_8: U1.A26(IO_L3N_M5A11_5)
XP4D_9: U1.G27(IO_L16P_M5DQ4_5)
XP4D_10: U1.F26(IO_L6P_M5A10_5)
XP4D_11: U1.D25(IO_L66N_SCP0_0)
XP4D_12: U1.C26(IO_L3P_M5RESET_5)
XP4D_13: U1.K20(IO_L55P_0)
XP4D_14: U1.J19(IO_L49N_0)
XP4D_15: U1.G19(IO_L52N_0)
XP4D_16: U1.G21(IO_L61N_0)
XP4D_17: U1.H18(IO_L53N_0)
XP4D_18: U1.K17(IO_L43N_0)
XP4D_19: U1.D16(IO_L37N_GCLK12_0)
XP4D_22: U1.B17(IO_L38P_0)
XP4D_23: U1.L11(IO_L11P_0)
XP4D_24: U1.L13(IO_L21N_0)
XP4D_25: U1.G15(IO_L34N_GCLK18_0)
XP4D_26: U1.B15(IO_L35P_GCLK17_0)
XP4D_27: U1.E15(IO_L33N_0)
XP4D_28: U1.F15(IO_L33P_0)
XP4D_29: U1.H13(IO_L19N_0)
XP4D_30: U1.F11(IO_L18P_0)
XP4D_31: U1.J12(IO_L17P_0)
XP4D_32: U1.H12(IO_L17N_0)
XP4D_33: U1.B6(IO_L8P_0)
XP4D_34: U1.H11(IO_L20P_0)
XP4D_35: U1.A4(IO_L80N_M4A12_4)
XP4D_36: U1.E9(IO_L16N_0)
XP4D_37: U1.B3(IO_L76P_M4A7_4)
XP4D_38: U1.F8(IO_L10P_0)

## Buses and harness runs
bus XP1A_[40..1]
bus XP1B_[40..1]
bus XP1C_[40..1]
bus XP1D_[40..1]
bus XP2A_[40..1]
bus XP2B_[40..1]
bus XP2C_[40..1]
bus XP2D_[40..1]
bus XP3A_[40..1]
bus XP3B_[40..1]
bus XP3C_[40..1]
bus XP3D_[40..1]
bus XP4A_[40..1]
bus XP4B_[40..1]
bus XP4C_[40..1]
bus XP4D_[40..1]

## Notes on the sheet
- XP4
- A1
- Mezzanine Serial Number
- Optical Control
- ADC SPI Bus
- 26 IOs + 4 Clocks
- XP2
- XP3
- (near R14) 40MHz TTC Clock
- XP1
- Date:
- Rev:
- Sheet
- of
- (in symbol XC6SLX150T-3FGG900C, part A) Top Left; Bank 0
- (in symbol XC6SLX150T-3FGG900C, part B) Bank 1; Right Top; Right Bottom
- (in symbol XC6SLX150T-3FGG900C, part C) Bank 2; Bottom Left; Bottom Right
- (in symbol XC6SLX150T-3FGG900C, part D) Left Bottom; Bank 3
- (in symbol XC6SLX150T-3FGG900C, part E) Left Top; Bank 4
- (in symbol XC6SLX150T-3FGG900C, part F) Bank 5; Right Top
- (in symbol XC6SLX150T-3FGG900C, part L) Left Top; Bank 3
- (in symbol XC6SLX150T-3FGG900C, part M) Top Right; Bank 0

## Library data of the parts
R13 R14 = ERJ-2RKF1100X: RES SMD 110 OHM 1% 1/10W 0402; Manufacturer: Panasonic Electronic Components; Power (Watts): 0.1W, 1/10W; Temperature Coefficient: ±100ppm/°C; Supplier 1: Digi-Key; Manufacturer Part Number: ERJ-2RKF1100X; RoHS: RoHS Compliant; Category: Resistors; Stock 1: 171366; Pricing 1: 1=0.1, 10=0.039, 100=0.016, 1000=0.00719, 2500=0.00624, 5000=0.00515 (USD); Packaging: Cut Tape (CT); Part Status: Active; Composition: Thick Film; Features: Automotive AEC-Q200; Operating Temperature: -55°C ~ 155°C; Package / Case: 0402 (1005 Metric); Size / Dimension: 0.039" L x 0.020" W (1.00mm x 0.50mm); Height - Seated (Max): 0.016" (0.40mm); Failure Rate: -; ComponentLink1URL: https://industrial.panasonic.com/cdbs/www-data/pdf/RDA0000/AOA0000C304.pdf; ComponentLink1Description: https://industrial.panasonic.com/cdbs/www-data/pdf/RDA0000/AOA0000C304.pdf; Supplier 2: Digi-Key; Stock 2: 171366; Pricing 2: 1=0.1, 10=0.039, 100=0.016, 1000=0.00719, 2500=0.00624, 5000=0.00515 (USD); Supplier Part Number 1: P110LCT-ND; Supplier Part Number 2: P110LDKR-ND; Tolerance: ±1%
U1 = XC6SLX150T-3FGG900C: Spartan-6 LXT 1.2V FPGA, 540 User I/Os, 900-Ball Chip-Scale BGA (1.0mm Pitch), Speed Grade 3, Commercial Grade, Pb-Free; Manufacturer: Xilinx Inc.; Number of I/O: 540; Voltage - Supply: 1.14 V ~ 1.26 V; DatasheetVersion: ver1.6, Nov-2010; PackageVersion: ver1.4, Nov-2009; PackageReference: FGG900; PackageDescription: 900-Ball Fine-Pitch Ball Grid Array (FGG900) - Pb-Free; Code_JEDEC: MS-034-AAN-1; Code_IPC: BGA100P30X30-900; ComponentLink1Description: Manufacturer URL; ComponentLink1URL: http://www.xilinx.com/; ComponentLink2Description: Spartan-6 Datasheet; ComponentLink2URL: http://www.xilinx.com/support/documentation/data_sheets/ds160.pdf; ComponentLink3Description: Spartan-6 Documents; ComponentLink3URL: http://www.xilinx.com/support/documentation/spartan-6.htm; Supplier 1: Digi-Key; Manufacturer Part Number: XC6SLX150T-3FGG900C; RoHS: RoHS Compliant; Category: Integrated Circuits (ICs); Stock 1: 0; Pricing 1: 27=287.3 (USD); Part Status: Active; Mounting Type: Surface Mount; Operating Temperature: 0°C ~ 85°C (TJ); Package / Case: 900-BBGA; Supplier Device Package: 900-FBGA (31x31); ComponentLink4URL: http://www.xilinx.com/support/documentation/data_sheets/ds162.pdf; ComponentLink4Description: http://www.xilinx.com/support/documentation/data_sheets/ds162.pdf; Supplier Part Number 1: XC6SLX150T-3FGG900C-ND